# Altium project PCB_Project2.PrjPCB
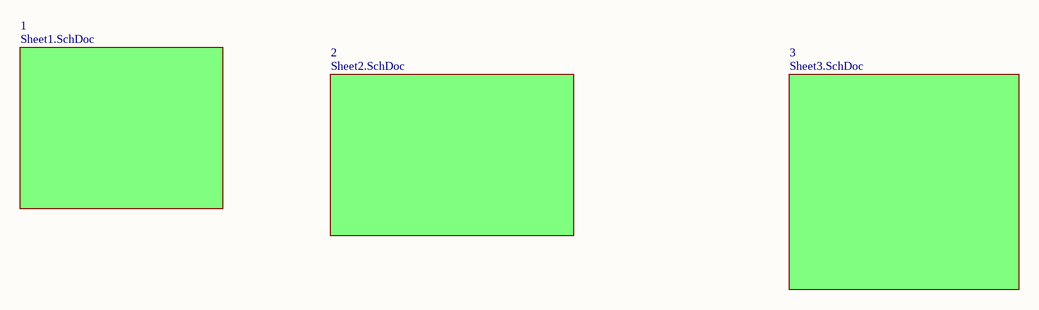
[diagram p0: total.SchDoc]
4 sheets, 146 parts. Net scope: global (net labels, ports and power ports of the same name join across sheets).
Board file: radarr.PcbDoc
Sheets:
  total.SchDoc
    1 = Sheet1.SchDoc
    2 = Sheet2.SchDoc
    3 = Sheet3.SchDoc

## Sheet total.SchDoc
size A4

### Sub-sheets
1 = Sheet1.SchDoc: no entries
2 = Sheet2.SchDoc: no entries
3 = Sheet3.SchDoc: no entries

## Sheet Sheet1.SchDoc
size A4
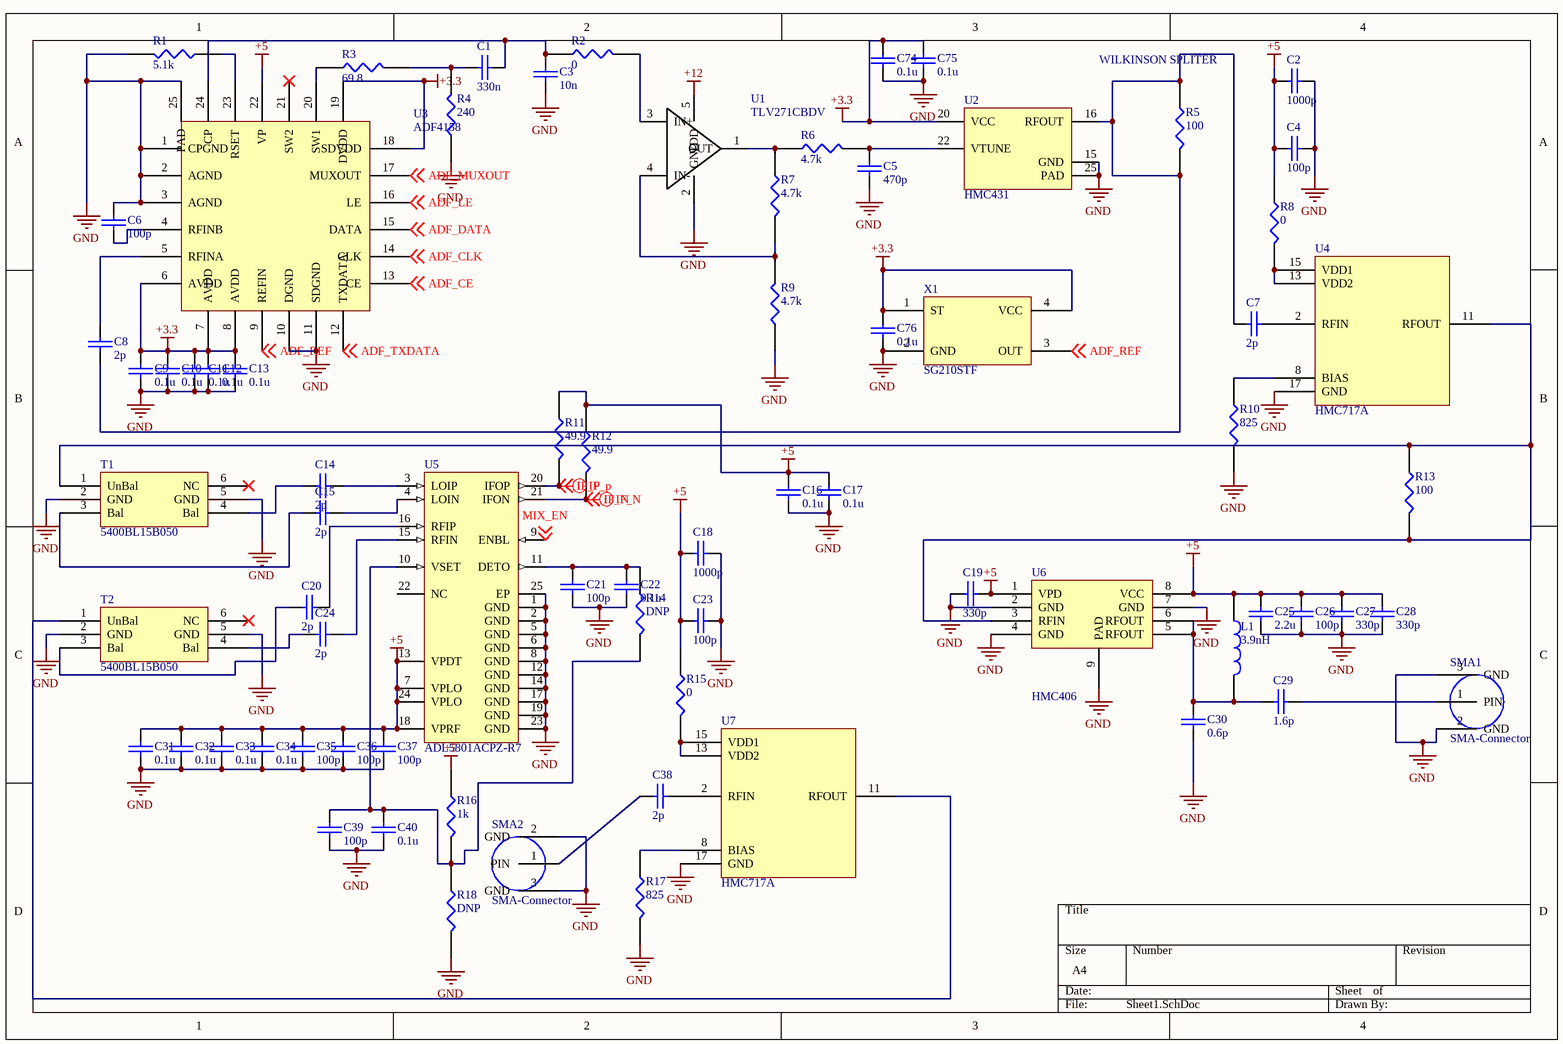
[diagram p1: Sheet1.SchDoc]

### Parts
C1  330n  [0603_R]
C2  1000p  [0603_R]
C3  10n  [0603_R]
C4  100p  [0603_R]
C5  470p  [0603_R]
C6  100p  [0603_R]
C7  2p  [0603_R]
C8  2p  [0603_R]
C9  0.1u  [0603_R]
C10  0.1u  [0603_R]
C11  0.1u  [0603_R]
C12  0.1u  [0603_R]
C13  0.1u  [0603_R]
C14  2p  [0603_R]
C15  2p  [0603_R]
C16  0.1u  [0603_R]
C17  0.1u  [0603_R]
C18  1000p  [0603_R]
C19  330p  [0603_R]
C20  2p  [0603_R]
C21  100p  [0603_R]
C22  0.1u  [0603_R]
C23  100p  [0603_R]
C24  2p  [0603_R]
C25  2.2u  [0603_R]
C26  100p  [0603_R]
C27  330p  [0603_R]
C28  330p  [0603_R]
C29  1.6p  [0603_R]
C30  0.6p  [0603_R]
C31  0.1u  [0603_R]
C32  0.1u  [0603_R]
C33  0.1u  [0603_R]
C34  0.1u  [0603_R]
C35  100p  [0603_R]
C36  100p  [0603_R]
C37  100p  [0603_R]
C38  2p  [0603_R]
C39  100p  [0603_R]
C40  0.1u  [0603_R]
C74  0.1u  [0603_R]
C75  0.1u  [0603_R]
C76  0.1u  [0603_R]
L1  3.9nH  [0603_R]
R1  5.1k  [0603_R]
R2  0  [0603_R]
R3  69.8  [0603_R]
R4  240  [0603_R]
R5  100  [0603_R]
R6  4.7k  [0603_R]
R7  4.7k  [0603_R]
R8  0  [0603_R]
R9  4.7k  [0603_R]
R10  825  [0603_R]
R11  49.9  [0603_R]
R12  49.9  [0603_R]
R13  100  [0603_R]
R14  DNP  [0603_R]
R15  0  [0603_R]
R16  1k  [0603_R]
R17  825  [0603_R]
R18  DNP  [0603_R]
SMA1  SMA-Connector  [SMA-2]
SMA2  SMA-Connector  [SMA-2]
T1  5400BL15B050  [0603-6]
T2  5400BL15B050  [0603-6]
U1  TLV271CBDV  [LT-S5-5-TSOT-23_L]
U2  HMC431  [LCC24-HMC431]
U3  ADF4158  [LCC24_ADF4158]
U4  HMC717A  [LCC16-717A]
U5  ADL5801ACPZ-R7  [ADI-CP-24-3_N]
U6  HMC406
U7  HMC717A  [LCC16-717A]
X1  SG210STF  [SG210STF]

### Nets
+3.3: C9.1 C10.1 C11.1 C12.1 C13.1 C74.2 C75.2 C76.1 U2.20(VCC) U3.6(AVDD) U3.7(AVDD) U3.8(AVDD) U3.18(SDVDD) U3.19(DVDD) X1.1(ST) X1.4(VCC)
+5: C2.1 C4.1 C16.2 C17.2 C18.1 C19.1 C23.1 C25.2 C26.2 C27.2 C28.2 C31.2 C32.2 C33.2 C34.2 C35.2 C36.2 C37.2 L1.1 R8.1 R11.1 R12.1 R15.1 R16.1 U3.22(VP) U5.7(VPLO) U5.13(VPDT) U5.18(VPRF) U5.24(VPLO) U6.1(VPD) U6.8(VCC)
+12: U1.5(VDD)
GND: C2.2 C3.2 C4.2 C5.2 C6.1 C9.2 C10.2 C11.2 C12.2 C13.2 C16.1 C17.1 C18.2 C19.2 C21.1 C22.1 C23.2 C25.1 C26.1 C27.1 C28.1 C30.1 C31.1 C32.1 C33.1 C34.1 C35.1 C36.1 C37.1 C39.1 C40.1 C74.1 C75.1 C76.2 R1.2 R4.1 R9.1 R10.2 R17.2 R18.2 SMA1.2(GND) SMA1.3(GND) SMA2.2(GND) SMA2.3(GND) T1.2(GND) T1.5(GND) T2.2(GND) T2.5(GND) U1.2(GND) U2.15(GND) U2.25(PAD) U3.1(CPGND) U3.2(AGND) U3.3(AGND) U3.10(DGND) U3.11(SDGND) U3.25(PAD) U4.17(GND) U5.1(GND) U5.2(GND) U5.5(GND) U5.6(GND) U5.8(GND) U5.12(GND) U5.14(GND) U5.17(GND) U5.19(GND) U5.23(GND) U5.25(EP) U6.2(GND) U6.4(GND) U6.7(GND) U6.9(PAD) U7.17(GND) X1.2(GND)
ADF_CE: U3.13(CE) ; off-sheet ADF_CE
ADF_CLK: U3.14(CLK) ; off-sheet ADF_CLK
ADF_DATA: U3.15(DATA) ; off-sheet ADF_DATA
ADF_LE: U3.16(LE) ; off-sheet ADF_LE
ADF_MUXOUT: U3.17(MUXOUT) ; off-sheet ADF_MUXOUT
ADF_REF: U3.9(REFIN) X1.3(OUT) ; off-sheet ADF_REF
ADF_TXDATA: U3.12(TXDATA) ; off-sheet ADF_TXDATA
IF_N: R12.2 U5.21(IFON) ; off-sheet IF_N
IF_P: R11.2 U5.20(IFOP) ; off-sheet IF_P
MIX_EN: U5.9(ENBL) ; off-sheet MIX_EN
NetC1_1: C1.1 R3.2 R4.2
NetC1_2: C1.2 C3.1 R2.1 U3.24(CP)
NetC5_1: C5.1 R6.2 U2.22(VTUNE)
NetC6_2: C6.2 U3.4(RFINB)
NetC7_1: C7.1 C8.2 R5.1 R5.2 U2.16(RFOUT)
NetC7_2: C7.2 U4.2(RFIN)
NetC8_1: C8.1 U3.5(RFINA)
NetC14_1: C14.1 T1.4(Bal)
NetC14_2: C14.2 U5.3(LOIP)
NetC15_1: C15.1 T1.3(Bal)
NetC15_2: C15.2 U5.4(LOIN)
NetC20_1: C20.1 T2.3(Bal)
NetC20_2: C20.2 U5.16(RFIP)
NetC21_2: C21.2 C22.2 R14.1 U5.11(DETO)
NetC24_1: C24.1 T2.4(Bal)
NetC24_2: C24.2 U5.15(RFIN)
NetC29_1: C29.1 SMA1.1(PIN)
NetC29_2: C29.2 C30.2 L1.2 U6.5(RFOUT) U6.6(RFOUT)
NetC38_1: C38.1 SMA2.1(PIN)
NetC38_2: C38.2 U7.2(RFIN)
NetC39_2: C39.2 C40.2 R14.2 R16.2 R18.1 U5.10(VSET)
NetR1_1: R1.1 U3.23(RSET)
NetR2_2: R2.2 U1.3(IN+)
NetR3_1: R3.1 U3.20(SW1)
NetR6_1: R6.1 R7.1 U1.1(OUT)
NetR7_2: R7.2 R9.2 U1.4(IN-)
NetR8_2: R8.2 U4.13(VDD2) U4.15(VDD1)
NetR10_1: R10.1 U4.8(BIAS)
NetR13_1: R13.1 R13.2 T1.1(UnBal) U4.11(RFOUT) U6.3(RFIN)
NetR15_2: R15.2 U7.13(VDD2) U7.15(VDD1)
NetR17_1: R17.1 U7.8(BIAS)
NetT2_1: T2.1(UnBal) U7.11(RFOUT)

Not connected (* = marked no-connect by the designer): T1 6(NC)*; T2 6(NC)*; U3 21(SW2)*; U5 22(NC)

### Layout directives
differential pair: IF_N, IF_P

### Notes on the sheet
- WILKINSON SPLITER

### Library data of the parts
C1-C40 C74-C76 = CAP: Capacitor
L1 = INDUCTOR
R1-R18 = RES1
U3 = ADF4518
U5 = ADL5801ACPZ-R7: High IP3, 10 MHz to 6 GHz, Active Mixer, 130mA Supply Current, CP-24-3, Pb-Free, 1500 Reel; RF Frequency (MHZ): 10 to 6000; IF Frequency (MHz): LF to 3000; Conversion Gain (dB): 1.8dB; IP3 (dBm): 28.5; P1dB (dBm): 13.3; NF (dB): 9.75dB; DatasheetVersion: Rev. A; PackageVersion: Jan-2005; PackageReference: CP-24-3; PackageDescription: 24-Lead Lead Frame Chip Scale Package [LFCSP_VQ]; LO Frequency (MHz): 10 to 6000; Code_JEDEC: MO-220-VGGD-8; ComponentLink1Description: Manufacturer URL; ComponentLink1URL: www.analog.com; ComponentLink2Description: Datasheet; ComponentLink2URL: http://www.analog.com/static/imported-files/data_sheets/ADL5801.pdf; ComponentLink3Description: Package Specification; ComponentLink3URL: http://www.analog.com/static/imported-files/packages/56702234806764CP_24_3.pdf

## Sheet Sheet2.SchDoc
size A4
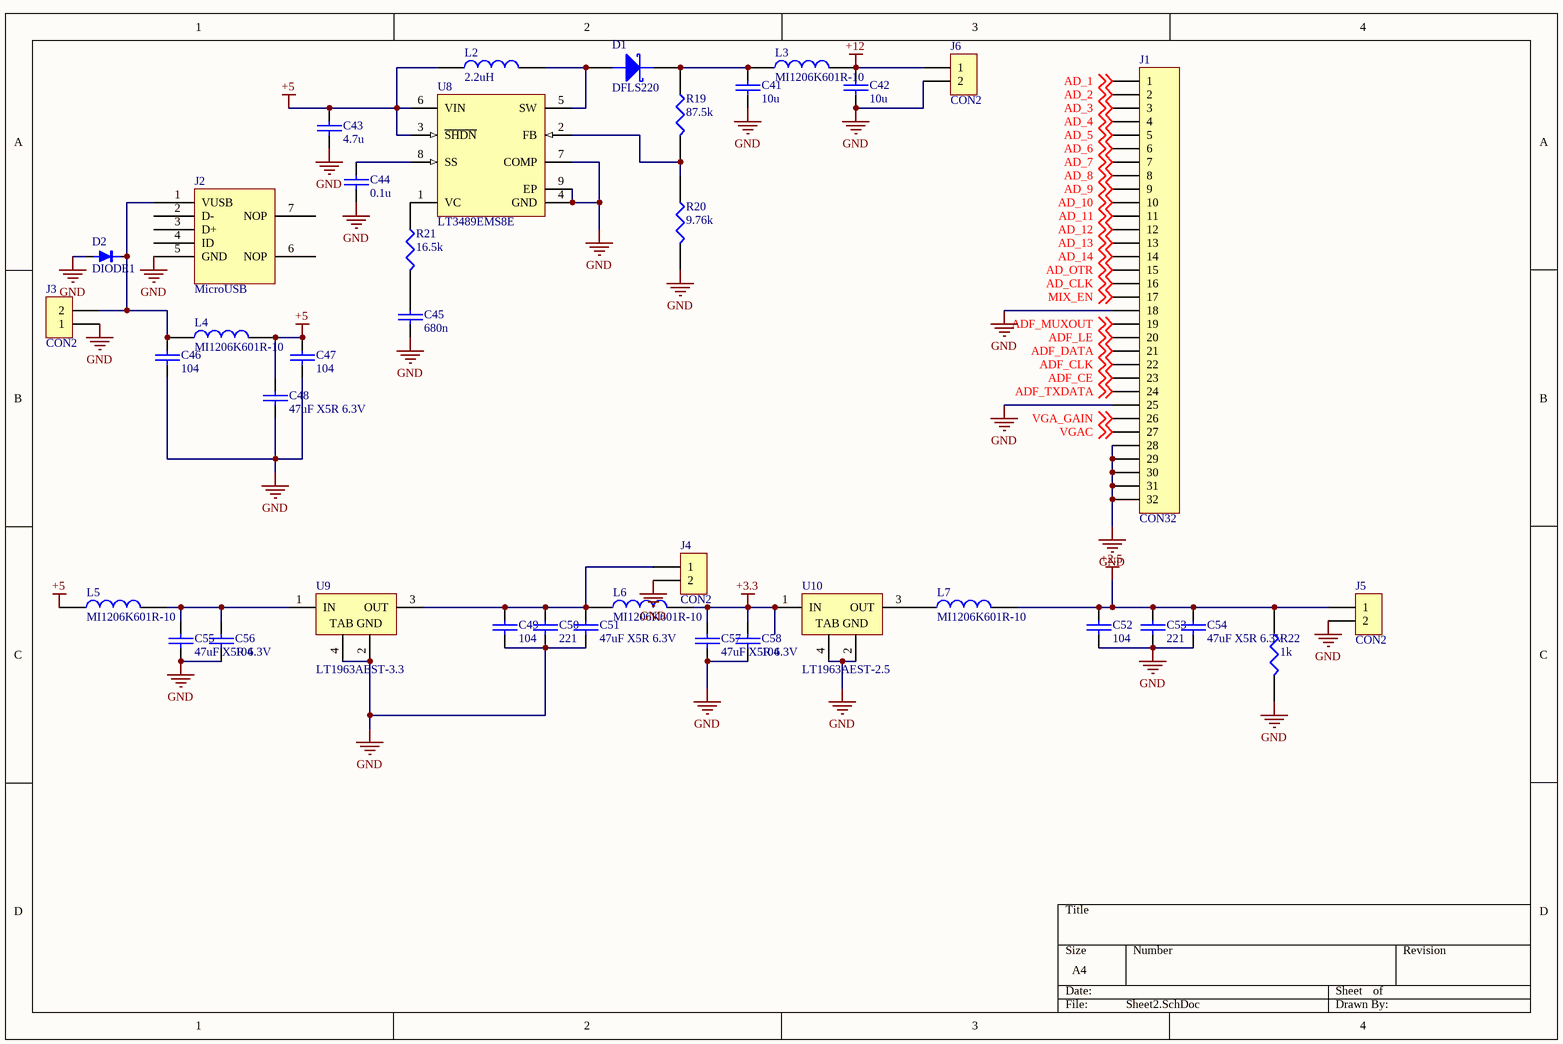
[diagram p2: Sheet2.SchDoc]

### Parts
C41  10u  [0603_R]
C42  10u  [0603_R]
C43  4.7u  [0603_R]
C44  0.1u  [0603_R]
C45  680n  [0603_R]
C46  104  [0603_C]
C47  104  [0603_C]
C48  47uF X5R 6.3V  [CD2012-0805]
C49  104  [0603_R]
C50  221  [0603_R]
C51  47uF X5R 6.3V  [CD2012-0805]
C52  104  [0603_R]
C53  221  [0603_R]
C54  47uF X5R 6.3V  [CD2012-0805]
C55  47uF X5R 6.3V  [CD2012-0805]
C56  104  [0603_R]
C57  47uF X5R 6.3V  [CD2012-0805]
C58  104  [0603_R]
D1  DFLS220  [SOD123]
D2  DIODE1  [DIODE0.4A]
J1  CON32  [CON32]
J2  MicroUSB  [MICRO-USB]
J3  CON2  [SIP2]
J4  CON2  [SIP2]
J5  CON2  [SIP2]
J6  CON2  [SIP2]
L2  2.2uH  [CD4532-1812]
L3  MI1206K601R-10  [1206]
L4  MI1206K601R-10  [1206]
L5  MI1206K601R-10  [1206]
L6  MI1206K601R-10  [1206]
L7  MI1206K601R-10  [1206]
R19  87.5k  [0603_R]
R20  9.76k  [0603_R]
R21  16.5k  [0603_R]
R22  1k  [0603_R]
U8  LT3489EMS8E  [LT-MS8E-8-2060X1830TP_N]
U9  LT1963AEST-3.3  [LT-ST-3-SOT-223_N]
U10  LT1963AEST-2.5  [LT-ST-3-SOT-223_N]

### Nets
+2.5: C52.1 C53.1 C54.1 J5.1 L7.2 R22.1
+3.3: C57.1 C58.1 L6.2 U10.1(IN)
+5: C43.1 C47.1 C48.1 L2.1 L4.2 L5.1 U8.3(~{SHDN}) U8.6(VIN)
+12: C42.1 J6.1 L3.2
GND: C41.2 C42.2 C43.2 C44.2 C45.2 C46.2 C47.2 C48.2 C49.2 C50.2 C51.2 C52.2 C53.2 C54.2 C55.2 C56.2 C57.2 C58.2 D2.A J1.18 J1.25 J1.28 J1.29 J1.30 J1.31 J1.32 J2.5(GND) J3.1 J4.2 J5.2 J6.2 R20.2 R22.2 U8.4(GND) U8.7(COMP) U8.9(EP) U9.2(GND) U9.4(TAB) U10.2(GND) U10.4(TAB)
AD_1: J1.1 ; off-sheet AD_1
AD_2: J1.2 ; off-sheet AD_2
AD_3: J1.3 ; off-sheet AD_3
AD_4: J1.4 ; off-sheet AD_4
AD_5: J1.5 ; off-sheet AD_5
AD_6: J1.6 ; off-sheet AD_6
AD_7: J1.7 ; off-sheet AD_7
AD_8: J1.8 ; off-sheet AD_8
AD_9: J1.9 ; off-sheet AD_9
AD_10: J1.10 ; off-sheet AD_10
AD_11: J1.11 ; off-sheet AD_11
AD_12: J1.12 ; off-sheet AD_12
AD_13: J1.13 ; off-sheet AD_13
AD_14: J1.14 ; off-sheet AD_14
AD_CLK: J1.16 ; off-sheet AD_CLK
AD_OTR: J1.15 ; off-sheet AD_OTR
ADF_CE: J1.23 ; off-sheet ADF_CE
ADF_CLK: J1.22 ; off-sheet ADF_CLK
ADF_DATA: J1.21 ; off-sheet ADF_DATA
ADF_LE: J1.20 ; off-sheet ADF_LE
ADF_MUXOUT: J1.19 ; off-sheet ADF_MUXOUT
ADF_TXDATA: J1.24 ; off-sheet ADF_TXDATA
MIX_EN: J1.17 ; off-sheet MIX_EN
VGA_GAIN: J1.26 ; off-sheet VGA_GAIN
VGAC: J1.27 ; off-sheet VGAC
NetC41_1: C41.1 D1.2(K) L3.1 R19.1
NetC44_1: C44.1 U8.8(SS)
NetC45_1: C45.1 R21.2
NetC46_1: C46.1 D2.K J2.1(VUSB) J3.2 L4.1
NetC49_1: C49.1 C50.1 C51.1 J4.1 L6.1 U9.3(OUT)
NetC55_1: C55.1 C56.1 L5.2 U9.1(IN)
NetD1_1: D1.1(A) L2.2 U8.5(SW)
NetL7_1: L7.1 U10.3(OUT)
NetR19_2: R19.2 R20.1 U8.2(FB)
NetR21_1: R21.1 U8.1(VC)

Not connected (* = marked no-connect by the designer): J2 2(D-) 3(D+) 4(ID) 6(NOP) 7(NOP)

### Library data of the parts
C41-C58 = CAP: Capacitor
D1 = DIODE SCHOTTKY: Schottky Diode
J1 = CON32: Connector
L2-L7 = INDUCTOR
R19-R22 = RES1
U8 = LT3489EMS8E: 2 MHz Boost DC/DC Converter with 2.5 A Switch and Soft-Start, 8-pin SOP (MS8E-8), -40 to 85 degC; Manufacturer: Linear Technology; Number of Outputs: 1; PackageVersion: Rev. E; PackageReference: MS8E-8; PackageDescription: 8-Pin Plastic MSOP, Exposed Die Pad, Body 3 x 3 mm, Pitch 0.65 mm; RoHS: FALSE; Mounting Technology: Surface Mount; PartNumber: LT3489EMS8E; ComponentLink1Description: Manufacturer URL; ComponentLink1URL: http://www.linear.com/; ComponentLink2Description: Datasheet; ComponentLink2URL: http://cds.linear.com/docs/en/datasheet/3489f.pdf; ComponentLink3Description: Package Specification; ComponentLink3URL: http://cds.linear.com/docs/en/datasheet/4070fc.pdf
U9 U10 = LT1963AEST-3.3: 1.5 A, Low Noise, Fast Transient Response LDO Regulator, 2.1 to 20 V Vin, 3.3 V Vout, 3-pin SOT223 (ST-3), -40 to 125 degC; Manufacturer: Linear Technology; Discrete Pass Element: no; Dropout Voltage(V): 0.34; Iout(mA): 1500; Isupply(mA): 1; Noise(uV): 40; Output Voltage: 3.3 V; PSRR(dB): 63; Shutdown Current(uA): 0.01; Vin Max(V): 20; Vin Min(V): 2.1; DatasheetVersion: Rev. E; PackageVersion: Jun-10; PackageReference: ST-3; PackageDescription: 3-Pin Plastic SOT-223, 3.505 x 6.505 mm Body, Pitch 2.3 mm; Supplier 1: Digi-Key; Supplier Part Number 1: LT1963AEST-3.3-ND; Supplier 2: Newark; Supplier Part Number 2: 57M7458; Number of Outputs: 1; RoHS: FALSE; Mounting Technology: Surface Mount; PartNumber: LT1963AEST-3.3; ComponentLink1Description: Manufacturer URL; ComponentLink1URL: http://www.linear.com/; ComponentLink2Description: Datasheet; ComponentLink2URL: http://cds.linear.com/docs/en/datasheet/1963afe.pdf; ComponentLink3Description: Package Specification; ComponentLink3URL: http://cds.linear.com/docs/en/packaging/SOT_3_05-08-1630.pdf

## Sheet Sheet3.SchDoc
size A4
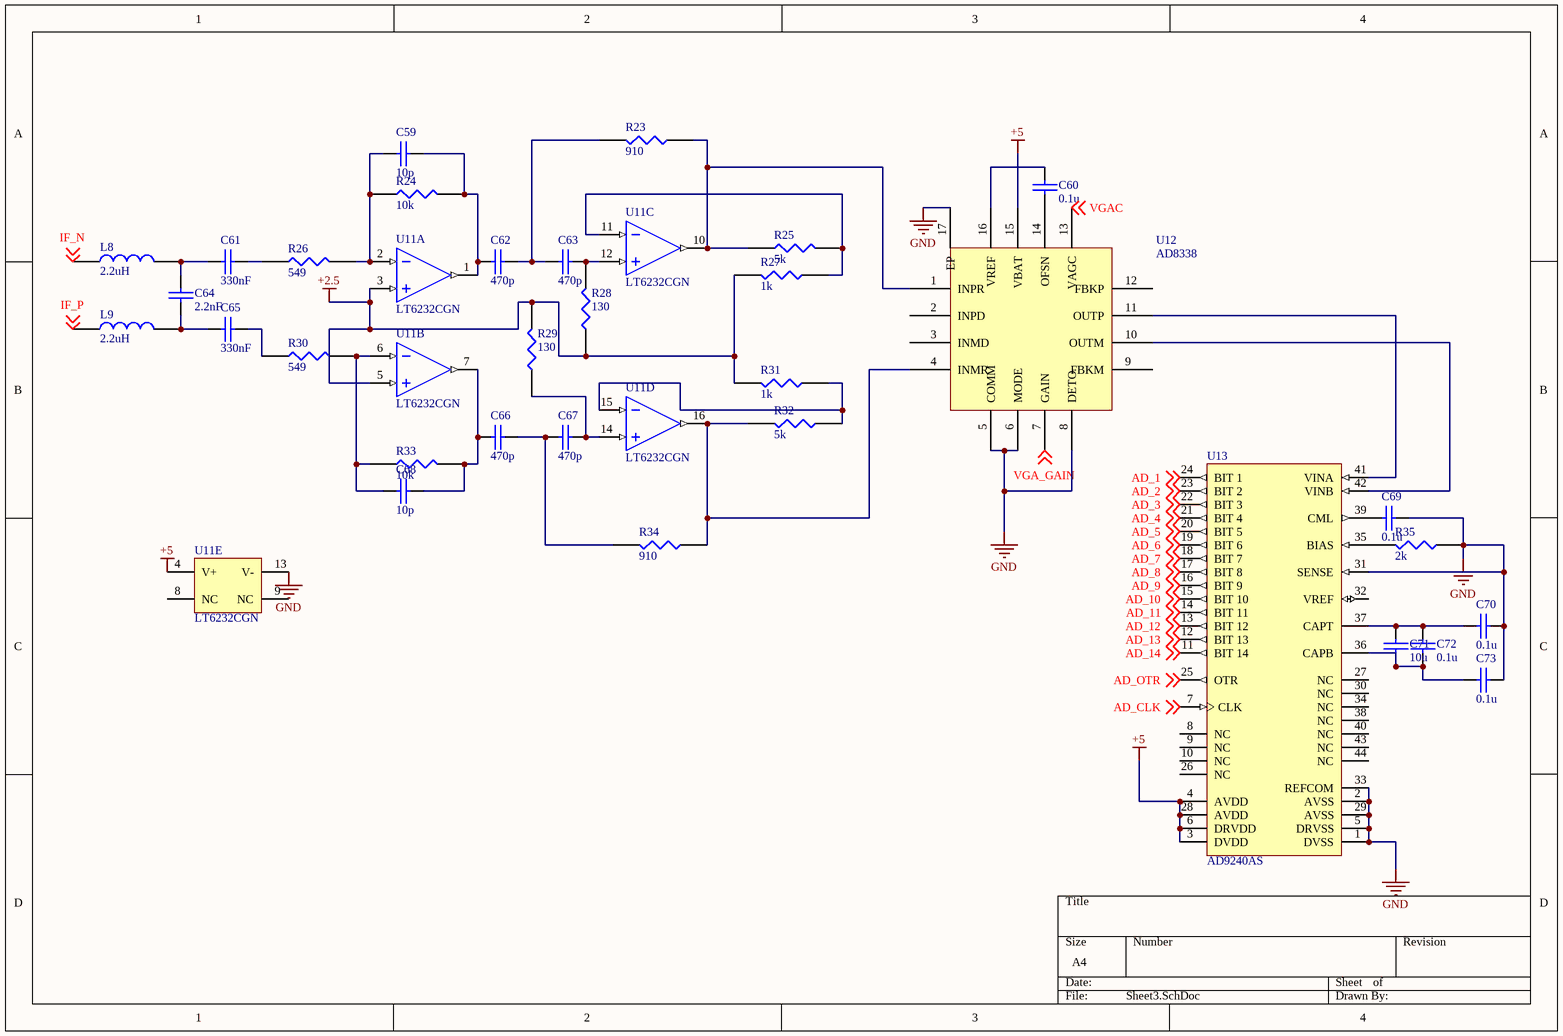
[diagram p3: Sheet3.SchDoc]

### Parts
C59  10p  [0603_R]
C60  0.1u  [0603_R]
C61  330nF  [0603_R]
C62  470p  [0603_R]
C63  470p  [0603_R]
C64  2.2nF  [0603_R]
C65  330nF  [0603_R]
C66  470p  [0603_R]
C67  470p  [0603_R]
C68  10p  [0603_R]
C69  0.1u  [0603_R]
C70  0.1u  [0603_R]
C71  10u  [0603_R]
C72  0.1u  [0603_R]
C73  0.1u  [0603_R]
L8  2.2uH  [0603_R]
L9  2.2uH  [0603_R]
R23  910  [0603_R]
R24  10k  [0603_R]
R25  5k  [0603_R]
R26  549  [0603_R]
R27  1k  [0603_R]
R28  130  [0603_R]
R29  130  [0603_R]
R30  549  [0603_R]
R31  1k  [0603_R]
R32  5k  [0603_R]
R33  10k  [0603_R]
R34  910  [0603_R]
R35  2k  [0603_R]
U11  LT6232CGN  [LT-GN-16_N]  (parts A,B,C,D,E of 5)
U12  AD8338  [LCC16-AD8338]
U13  AD9240AS  [S-44-1_N]

### Nets
+2.5: R27.2 R28.1 R29.2 R31.2 U11.3(+IN_A) U11.5(+IN_B)
+5: U11.4(V+) U12.15(VBAT) U13.3(DVDD) U13.4(AVDD) U13.6(DRVDD) U13.28(AVDD)
GND: C69.2 C70.2 C73.2 R35.1 U11.13(V-) U12.5(COMM) U12.6(MODE) U12.8(DETO) U12.17(EP) U13.1(DVSS) U13.2(AVSS) U13.5(DRVSS) U13.29(AVSS) U13.31(SENSE) U13.33(REFCOM)
AD_1: U13.24(BIT_1) ; off-sheet AD_1
AD_2: U13.23(BIT_2) ; off-sheet AD_2
AD_3: U13.22(BIT_3) ; off-sheet AD_3
AD_4: U13.21(BIT_4) ; off-sheet AD_4
AD_5: U13.20(BIT_5) ; off-sheet AD_5
AD_6: U13.19(BIT_6) ; off-sheet AD_6
AD_7: U13.18(BIT_7) ; off-sheet AD_7
AD_8: U13.17(BIT_8) ; off-sheet AD_8
AD_9: U13.16(BIT_9) ; off-sheet AD_9
AD_10: U13.15(BIT_10) ; off-sheet AD_10
AD_11: U13.14(BIT_11) ; off-sheet AD_11
AD_12: U13.13(BIT_12) ; off-sheet AD_12
AD_13: U13.12(BIT_13) ; off-sheet AD_13
AD_14: U13.11(BIT_14) ; off-sheet AD_14
AD_CLK: U13.7(CLK) ; off-sheet AD_CLK
AD_OTR: U13.25(OTR) ; off-sheet AD_OTR
IF_N: L8.1 ; off-sheet IF_N
IF_P: L9.1 ; off-sheet IF_P
VGA_GAIN: U12.7(GAIN) ; off-sheet VGA_GAIN
VGAC: U12.13(VAGC) ; off-sheet VGAC
NetC59_1: C59.1 C62.2 R24.2 U11.1(OUT_A)
NetC59_2: C59.2 R24.1 R26.2 U11.2(-IN_A)
NetC60_1: C60.1 U12.16(VREF)
NetC60_2: C60.2 U12.14(OFSN)
NetC61_1: C61.1 R26.1
NetC61_2: C61.2 C64.2 L8.2
NetC62_1: C62.1 C63.2 R23.2
NetC63_1: C63.1 R28.2 U11.12(+IN_C)
NetC64_1: C64.1 C65.2 L9.2
NetC65_1: C65.1 R30.1
NetC66_1: C66.1 C67.2 R34.2
NetC66_2: C66.2 C68.1 R33.2 U11.7(OUT_B)
NetC67_1: C67.1 R29.1 U11.14(+IN_D)
NetC68_2: C68.2 R30.2 R33.1 U11.6(-IN_B)
NetC69_1: C69.1 U13.39(CML)
NetC70_1: C70.1 C71.2 C72.2 U13.37(CAPT)
NetC71_1: C71.1 C72.1 C73.1 U13.36(CAPB)
NetR23_1: R23.1 R25.1 U11.10(OUT_C) U12.1(INPR)
NetR25_2: R25.2 R27.1 U11.11(-IN_C)
NetR31_1: R31.1 R32.1 U11.15(-IN_D)
NetR32_2: R32.2 R34.1 U11.16(OUT_D) U12.4(INMR)
NetR35_2: R35.2 U13.35(BIAS)
NetU12_10: U12.10(OUTM) U13.42(VINB)
NetU12_11: U12.11(OUTP) U13.41(VINA)

Not connected (* = marked no-connect by the designer): U11 8(NC) 9(NC); U12 2(INPD) 3(INMD) 9(FBKM) 12(FBKP); U13 8(NC) 9(NC) 10(NC) 26(NC) 27(NC) 30(NC) 32(VREF) 34(NC) 38(NC) 40(NC) 43(NC) 44(NC)

### Library data of the parts
C59-C73 = CAP: Capacitor
L8 L9 = INDUCTOR
R23-R35 = RES1
U11 = LT6232CGN: Quad Channel, Ultralow Noise, Low Power, High Speed Operational Amplifier, 215 MHz Typical GBW, 70 V/us Typical SR, 3 to 12.6 V, 16-Pin SOP (GN-16), Commercial; Linear Technology Part Number: LT6232; Manufacturer: Linear Technology; Channels (#): 4; GBW (MHz) Typical: 215; Is (mA) Typical: 3.3; SR (V/us) Typical: 70; Vos (mV) Guaranteed: 0.35; Vos (mV) Typical: 0.05; Vs Max (V): 12.6; Vs Min (V): 3; DatasheetVersion: Rev. C; PackageVersion: Rev B; PackageReference: LT-GN-16; PackageDescription: 16-Lead Plastic SSOP, Body 4.9 x 3.9 mm, Pitch 0.635 mm; Supplier 1: Digi-Key; Supplier Part Number 1: LT6232CGN-ND; Type: VFB; Mounting Technology: Surface Mount; PartNumber: LT6232CGN; ComponentLink1Description: Manufacturer URL; ComponentLink1URL: http://www.linear.com/; ComponentLink2Description: Datasheet; ComponentLink2URL: http://cds.linear.com/docs/en/datasheet/623012fc.pdf; ComponentLink3Description: Package Specification; ComponentLink3URL: http://cds.linear.com/docs/en/packaging/05081641_B_GN16.pdf
U13 = AD9240AS: Single 14-Bit Monolithic Analog-to-Digital Converter with Parallel Interface, 10MSPS, -55 to +85 degC, S-44-1, Tray; Generic Part Number: AD9240; Manufacturer: Analog Devices; Resolution (Bits): 14; Channels: 1; Throughput Rate (SPS): 10M; Interface: Par; DatasheetVersion: Rev.B; PackageVersion: 041807-A; PackageReference: S-44-1; PackageDescription: 44-Lead Metric Quad Flat Package [MQFP]; Supplier 1: Digi-Key; Supplier Part Number 1: AD9240AS-ND; Supplier 2: Mouser; Supplier Part Number 2: 584-AD9240AS; RoHS: N; Packing: Tray; Mounting Technology: Surface Mount; Code_JEDEC: MS-022-AB-1; PartNumber: AD9240AS; ComponentLink1Description: Manufacturer URL; ComponentLink1URL: http://www.analog.com/en/index.html; ComponentLink2Description: Datasheet; ComponentLink2URL: http://www.analog.com/static/imported-files/data_sheets/AD9240.pdf; ComponentLink3Description: Package Specification; ComponentLink3URL: http://www.analog.com/static/imported-files/packages/217364S_44_1.pdf; ComponentLink4Description: Product URL; ComponentLink4URL: http://www.analog.com/en/analog-to-digital-converters/ad-converters/ad9240/products/product.html

## Nets that join several sheets
+2.5: Sheet2 (6 pins), Sheet3 (6 pins)
+3.3: Sheet1 (16 pins), Sheet2 (C57.1 C58.1 L6.2 U10.1)
+5: Sheet1 (31 pins), Sheet2 (8 pins), Sheet3 (6 pins)
+12: Sheet1 (U1.5), Sheet2 (C42.1 J6.1 L3.2)
GND: Sheet1 (75 pins), Sheet2 (40 pins), Sheet3 (15 pins)
AD_1: Sheet2 (J1.1), Sheet3 (U13.24)
AD_2: Sheet2 (J1.2), Sheet3 (U13.23)
AD_3: Sheet2 (J1.3), Sheet3 (U13.22)
AD_4: Sheet2 (J1.4), Sheet3 (U13.21)
AD_5: Sheet2 (J1.5), Sheet3 (U13.20)
AD_6: Sheet2 (J1.6), Sheet3 (U13.19)
AD_7: Sheet2 (J1.7), Sheet3 (U13.18)
AD_8: Sheet2 (J1.8), Sheet3 (U13.17)
AD_9: Sheet2 (J1.9), Sheet3 (U13.16)
AD_10: Sheet2 (J1.10), Sheet3 (U13.15)
AD_11: Sheet2 (J1.11), Sheet3 (U13.14)
AD_12: Sheet2 (J1.12), Sheet3 (U13.13)
AD_13: Sheet2 (J1.13), Sheet3 (U13.12)
AD_14: Sheet2 (J1.14), Sheet3 (U13.11)
AD_CLK: Sheet2 (J1.16), Sheet3 (U13.7)
AD_OTR: Sheet2 (J1.15), Sheet3 (U13.25)
ADF_CE: Sheet1 (U3.13), Sheet2 (J1.23)
ADF_CLK: Sheet1 (U3.14), Sheet2 (J1.22)
ADF_DATA: Sheet1 (U3.15), Sheet2 (J1.21)
ADF_LE: Sheet1 (U3.16), Sheet2 (J1.20)
ADF_MUXOUT: Sheet1 (U3.17), Sheet2 (J1.19)
ADF_TXDATA: Sheet1 (U3.12), Sheet2 (J1.24)
IF_N: Sheet1 (R12.2 U5.21), Sheet3 (L8.1)
IF_P: Sheet1 (R11.2 U5.20), Sheet3 (L9.1)
MIX_EN: Sheet1 (U5.9), Sheet2 (J1.17)
VGA_GAIN: Sheet2 (J1.26), Sheet3 (U12.7)
VGAC: Sheet2 (J1.27), Sheet3 (U12.13)